# Altium schematic sheet MOUTING.SchDoc
size 420 x 297 mm; SheetNumber: 35; SheetTotal: 35
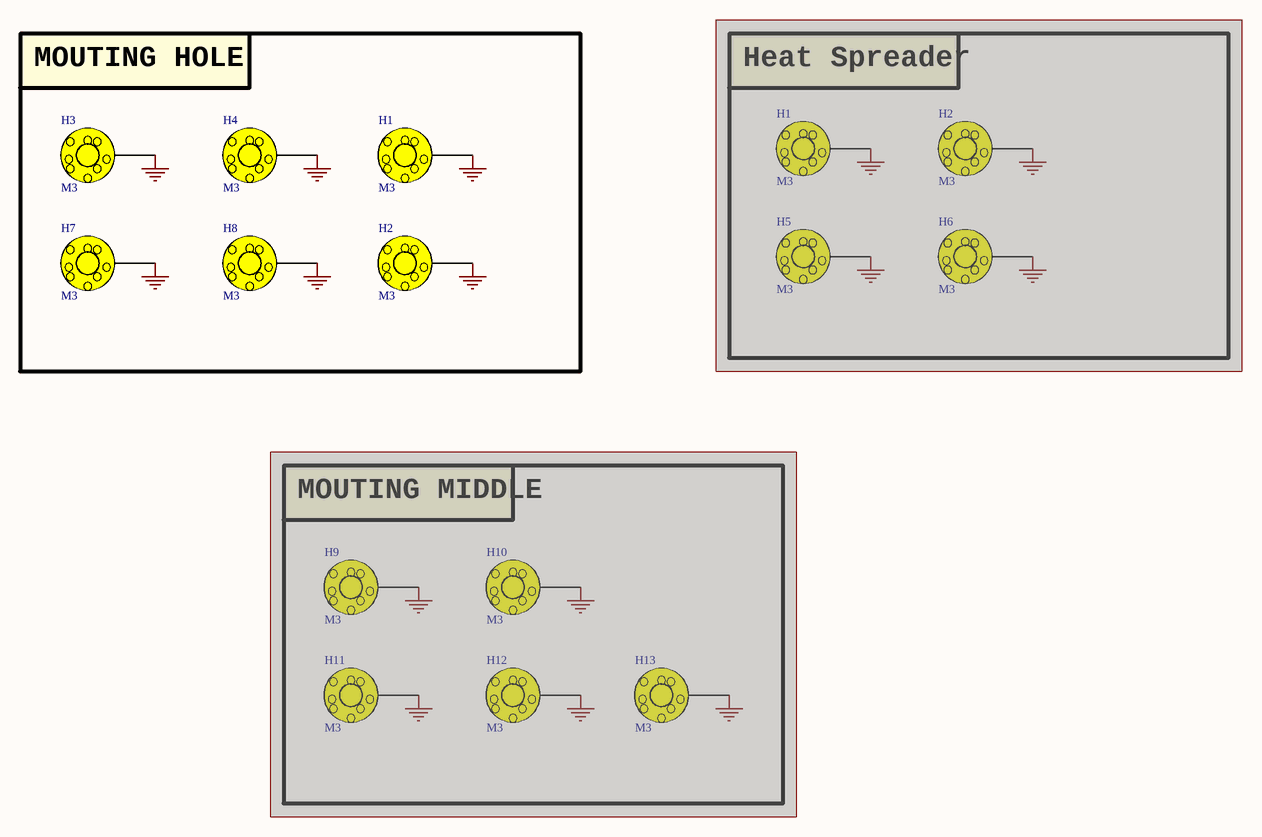
[diagram p0: MOUTING.SchDoc]

## Parts
(Parts that share a designator on the sheet are numbered #1, #2 ... from top to bottom, then left to right.)
H1#1  M3  [HEX-M3_NoVia]  (masked out: inside a compile mask, not in the netlist)
H1#2  M3  [HEX-M3_NoVia]
H2#1  M3  [HEX-M3_NoVia]  (masked out: inside a compile mask, not in the netlist)
H2#2  M3  [HEX-M3_NoVia]
H3  M3  [HEX-M3_NoVia]
H4  M3  [HEX-M3_NoVia]
H5  M3  [HEX-M3_NoVia]  (masked out: inside a compile mask, not in the netlist)
H6  M3  [HEX-M3_NoVia]  (masked out: inside a compile mask, not in the netlist)
H7  M3  [HEX-M3_NoVia]
H8  M3  [HEX-M3_NoVia]
H9  M3  [HEX-M3_NoVia]  (masked out: inside a compile mask, not in the netlist)
H10  M3  [HEX-M3_NoVia]  (masked out: inside a compile mask, not in the netlist)
H11  M3  [HEX-M3_NoVia]  (masked out: inside a compile mask, not in the netlist)
H12  M3  [HEX-M3_NoVia]  (masked out: inside a compile mask, not in the netlist)
H13  M3  [HEX-M3_NoVia]  (masked out: inside a compile mask, not in the netlist)

## Blocks framed on the sheet
MOUTING HOLE: H1#2 H2#2 H3 H4 H7 H8
Heat Spreader: H1#1 H2#1 H5 H6
MOUTING MIDDLE: H9-H13

## Nets
GND: H1#2.1 H2#2.1 H3.1 H4.1 H7.1 H8.1

## Notes on the sheet
- Project:
- Sub-system:
- Design by:
- Sheet title:
- Sheet
- of
- Checked by:
- Approved by:
- Revision:
- Document No:
- Size:
- Date:
- A3

## Library data of the parts
H1#1 H1#2 H2#1 H2#2 H3-H13 = HEX-M3